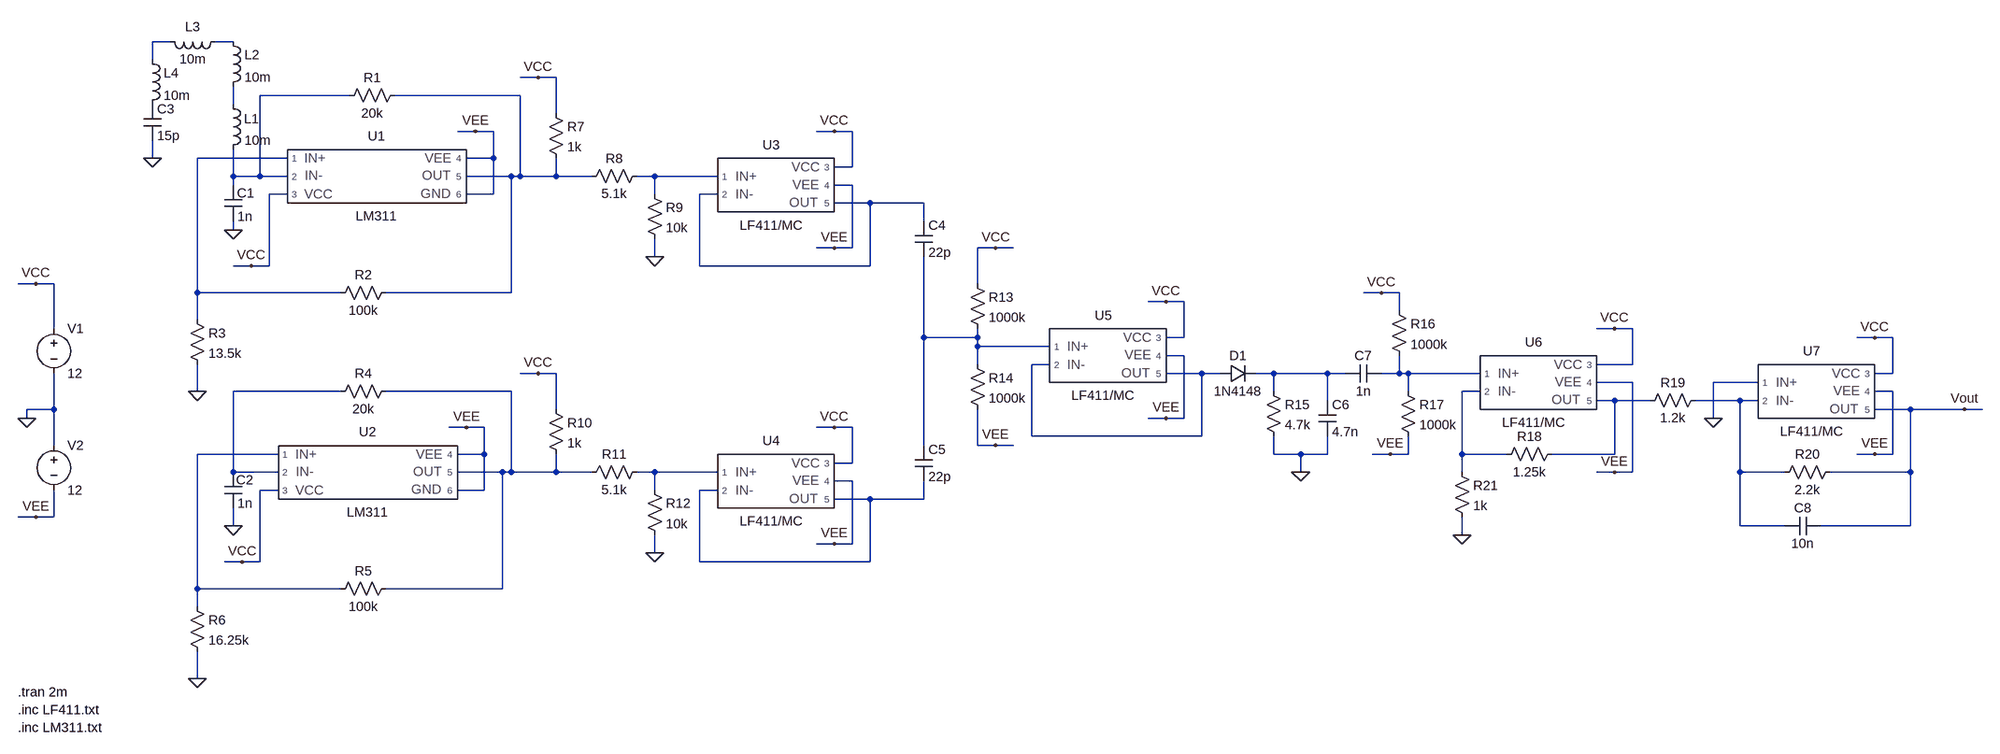
[diagram p0: schematic theremin.asc]
theremin.asc, the LTspice schematic file:
Version 4
SHEET 1 2708 820
WIRE -544 -480 -576 -480
WIRE -432 -480 -464 -480
WIRE -576 -448 -576 -480
WIRE 112 -416 80 -416
WIRE 144 -416 112 -416
WIRE -224 -384 -384 -384
WIRE 80 -384 -144 -384
WIRE -432 -368 -432 -400
WIRE 144 -352 144 -416
WIRE 0 -320 -32 -320
WIRE 32 -320 0 -320
WIRE 640 -320 608 -320
WIRE 672 -320 640 -320
WIRE -576 -272 -576 -304
WIRE -336 -272 -496 -272
WIRE 32 -272 32 -320
WIRE 32 -272 -16 -272
WIRE 672 -256 672 -320
WIRE 672 -256 640 -256
WIRE -432 -240 -432 -288
WIRE -384 -240 -384 -384
WIRE -384 -240 -432 -240
WIRE -336 -240 -384 -240
WIRE 64 -240 -16 -240
WIRE 80 -240 80 -384
WIRE 80 -240 64 -240
WIRE 144 -240 144 -272
WIRE 144 -240 80 -240
WIRE 208 -240 144 -240
WIRE 320 -240 288 -240
WIRE 432 -240 320 -240
WIRE -432 -224 -432 -240
WIRE 672 -224 640 -224
WIRE -336 -208 -368 -208
WIRE 32 -208 32 -272
WIRE 32 -208 -16 -208
WIRE 320 -208 320 -240
WIRE 432 -208 400 -208
WIRE 704 -192 640 -192
WIRE 800 -192 704 -192
WIRE 800 -160 800 -192
WIRE -432 -144 -432 -160
WIRE 640 -112 608 -112
WIRE 672 -112 672 -224
WIRE 672 -112 640 -112
WIRE 928 -112 896 -112
WIRE 960 -112 928 -112
WIRE 320 -96 320 -128
WIRE -400 -80 -432 -80
WIRE -368 -80 -368 -208
WIRE -368 -80 -400 -80
WIRE 400 -80 400 -208
WIRE 704 -80 704 -192
WIRE 704 -80 400 -80
WIRE -784 -48 -816 -48
WIRE -752 -48 -784 -48
WIRE 896 -48 896 -112
WIRE -496 -32 -496 -272
WIRE -240 -32 -496 -32
WIRE 64 -32 64 -240
WIRE 64 -32 -160 -32
WIRE 1616 -32 1584 -32
WIRE 1648 -32 1616 -32
WIRE 1232 -16 1200 -16
WIRE 1264 -16 1232 -16
WIRE 1648 0 1648 -32
WIRE -496 16 -496 -32
WIRE -752 32 -752 -48
WIRE 2032 32 2000 32
WIRE 2064 32 2032 32
WIRE 800 48 800 -96
WIRE 896 48 896 32
WIRE 896 48 800 48
WIRE 1264 48 1264 -16
WIRE 1264 48 1232 48
WIRE 2496 48 2464 48
WIRE 2528 48 2496 48
WIRE 896 64 896 48
WIRE 1024 64 896 64
WIRE 1264 80 1232 80
WIRE 896 96 896 64
WIRE 1024 96 992 96
WIRE 2064 96 2064 32
WIRE 2064 96 2000 96
WIRE 112 112 80 112
WIRE 144 112 112 112
WIRE 1296 112 1232 112
WIRE 1328 112 1296 112
WIRE 1424 112 1392 112
WIRE 1520 112 1424 112
WIRE 1552 112 1520 112
WIRE 1648 112 1648 80
WIRE 1648 112 1616 112
WIRE 1664 112 1648 112
WIRE 1792 112 1664 112
WIRE 2528 112 2528 48
WIRE 2528 112 2496 112
WIRE 2064 128 2000 128
WIRE 2288 128 2208 128
WIRE -496 144 -496 96
WIRE -240 144 -432 144
WIRE 64 144 -160 144
WIRE 1424 144 1424 112
WIRE 1664 144 1664 112
WIRE 1792 144 1760 144
WIRE 2528 144 2496 144
WIRE 1520 160 1520 112
WIRE 2032 160 2000 160
WIRE 2096 160 2032 160
WIRE 2256 160 2176 160
WIRE 2288 160 2256 160
WIRE -752 176 -752 112
WIRE -752 176 -800 176
WIRE 144 176 144 112
WIRE 2560 176 2496 176
WIRE 2656 176 2560 176
WIRE 2688 176 2656 176
WIRE -800 192 -800 176
WIRE 1232 192 1200 192
WIRE 1264 192 1264 80
WIRE 1264 192 1232 192
WIRE 2208 192 2208 128
WIRE -16 208 -48 208
WIRE 16 208 -16 208
WIRE 640 208 608 208
WIRE 672 208 640 208
WIRE 992 224 992 96
WIRE 1296 224 1296 112
WIRE 1296 224 992 224
WIRE -752 240 -752 176
WIRE 800 240 800 48
WIRE 896 240 896 176
WIRE 928 240 896 240
WIRE 960 240 928 240
WIRE -352 256 -496 256
WIRE 16 256 16 208
WIRE 16 256 -32 256
WIRE 1424 256 1424 224
WIRE 1472 256 1424 256
WIRE 1520 256 1520 224
WIRE 1520 256 1472 256
WIRE 1632 256 1600 256
WIRE 1664 256 1664 224
WIRE 1664 256 1632 256
WIRE 1760 256 1760 144
WIRE 1840 256 1760 256
WIRE 2032 256 2032 160
WIRE 2032 256 1920 256
WIRE 2496 256 2464 256
WIRE 2528 256 2528 144
WIRE 2528 256 2496 256
WIRE 672 272 672 208
WIRE 672 272 640 272
WIRE -432 288 -432 144
WIRE -352 288 -432 288
WIRE 48 288 -32 288
WIRE 64 288 64 144
WIRE 64 288 48 288
WIRE 144 288 144 256
WIRE 144 288 64 288
WIRE 208 288 144 288
WIRE 320 288 288 288
WIRE 432 288 320 288
WIRE 1472 288 1472 256
WIRE 1760 288 1760 256
WIRE 2032 288 2000 288
WIRE 2064 288 2064 128
WIRE 2064 288 2032 288
WIRE 2256 288 2256 160
WIRE 2336 288 2256 288
WIRE 2560 288 2560 176
WIRE 2560 288 2416 288
WIRE 672 304 640 304
WIRE -352 320 -384 320
WIRE 16 320 16 256
WIRE 16 320 -32 320
WIRE 320 320 320 288
WIRE 432 320 400 320
WIRE 704 336 640 336
WIRE 800 336 800 304
WIRE 800 336 704 336
WIRE -784 368 -816 368
WIRE -752 368 -752 320
WIRE -752 368 -784 368
WIRE -432 384 -432 352
WIRE 2256 384 2256 288
WIRE 2336 384 2256 384
WIRE 2560 384 2560 288
WIRE 2560 384 2400 384
WIRE 1760 400 1760 368
WIRE 640 416 608 416
WIRE 672 416 672 304
WIRE 672 416 640 416
WIRE 320 432 320 400
WIRE -416 448 -448 448
WIRE -384 448 -384 320
WIRE -384 448 -416 448
WIRE 400 448 400 320
WIRE 704 448 704 336
WIRE 704 448 400 448
WIRE -496 496 -496 256
WIRE -240 496 -496 496
WIRE 48 496 48 288
WIRE 48 496 -160 496
WIRE -496 528 -496 496
WIRE -496 656 -496 608
FLAG -800 192 0
FLAG -432 -144 0
FLAG -400 -80 VCC
FLAG -784 -48 VCC
FLAG -784 368 VEE
FLAG 0 -320 VEE
FLAG -496 144 0
FLAG -432 384 0
FLAG -416 448 VCC
FLAG -16 208 VEE
FLAG -496 656 0
FLAG -576 -272 0
FLAG 112 -416 VCC
FLAG 320 -96 0
FLAG 640 -320 VCC
FLAG 640 -112 VEE
FLAG 112 112 VCC
FLAG 320 432 0
FLAG 640 208 VCC
FLAG 640 416 VEE
FLAG 928 240 VEE
FLAG 928 -112 VCC
FLAG 1232 -16 VCC
FLAG 1232 192 VEE
FLAG 1472 288 0
FLAG 1616 -32 VCC
FLAG 1632 256 VEE
FLAG 2032 288 VEE
FLAG 2032 32 VCC
FLAG 2208 192 0
FLAG 2496 48 VCC
FLAG 2496 256 VEE
FLAG 1760 400 0
FLAG 2656 176 Vout
DATAFLAG 960 64 ""
SYMBOL Misc\\LM311 -176 -240 R0
SYMATTR InstName U1
SYMBOL cap -448 -224 R0
WINDOW 0 23 14 Left 2
SYMATTR InstName C1
SYMATTR Value 1n
SYMBOL res -128 -400 R90
WINDOW 0 0 56 VBottom 2
WINDOW 3 32 56 VTop 2
SYMATTR InstName R1
SYMATTR Value 20k
SYMBOL voltage -752 16 R0
WINDOW 123 0 0 Left 0
WINDOW 39 0 0 Left 0
SYMATTR InstName V1
SYMATTR Value 12
SYMBOL voltage -752 224 R0
WINDOW 123 0 0 Left 0
WINDOW 39 0 0 Left 0
SYMATTR InstName V2
SYMATTR Value 12
SYMBOL res -144 -48 R90
WINDOW 0 0 56 VBottom 2
WINDOW 3 32 56 VTop 2
SYMATTR InstName R2
SYMATTR Value 100k
SYMBOL res -512 0 R0
SYMATTR InstName R3
SYMATTR Value 13.5k
SYMBOL Misc\\LM311 -192 288 R0
SYMATTR InstName U2
SYMBOL cap -448 288 R0
WINDOW 0 21 14 Left 2
SYMATTR InstName C2
SYMATTR Value 1n
SYMBOL res -144 128 R90
WINDOW 0 0 56 VBottom 2
WINDOW 3 32 56 VTop 2
SYMATTR InstName R4
SYMATTR Value 20k
SYMBOL res -144 480 R90
WINDOW 0 0 56 VBottom 2
WINDOW 3 32 56 VTop 2
SYMATTR InstName R5
SYMATTR Value 100k
SYMBOL res -512 512 R0
SYMATTR InstName R6
SYMATTR Value 16.25k
SYMBOL ind -448 -384 R0
WINDOW 0 35 42 Left 2
SYMATTR InstName L1
SYMATTR Value 10m
SYMBOL ind -448 -496 R0
SYMATTR InstName L2
SYMATTR Value 10m
SYMBOL ind -448 -496 R90
WINDOW 0 5 56 VBottom 2
WINDOW 3 32 56 VTop 2
SYMATTR InstName L3
SYMATTR Value 10m
SYMBOL ind -592 -464 R0
SYMATTR InstName L4
SYMATTR Value 10m
SYMBOL Misc\\LF411_MC 528 -224 R0
SYMATTR InstName U3
SYMBOL cap -592 -368 R0
SYMATTR InstName C3
SYMATTR Value 15p
SYMBOL res 128 -368 R0
SYMATTR InstName R7
SYMATTR Value 1k
SYMBOL res 304 -256 R90
WINDOW 0 0 56 VBottom 2
WINDOW 3 32 56 VTop 2
SYMATTR InstName R8
SYMATTR Value 5.1k
SYMBOL res 304 -224 R0
SYMATTR InstName R9
SYMATTR Value 10k
SYMBOL cap 784 -160 R0
SYMATTR InstName C4
SYMATTR Value 22p
SYMBOL Misc\\LF411_MC 528 304 R0
SYMATTR InstName U4
SYMBOL res 128 160 R0
SYMATTR InstName R10
SYMATTR Value 1k
SYMBOL res 304 272 R90
WINDOW 0 0 56 VBottom 2
WINDOW 3 32 56 VTop 2
SYMATTR InstName R11
SYMATTR Value 5.1k
SYMBOL res 304 304 R0
SYMATTR InstName R12
SYMATTR Value 10k
SYMBOL cap 784 240 R0
SYMATTR InstName C5
SYMATTR Value 22p
SYMBOL res 880 -64 R0
SYMATTR InstName R13
SYMATTR Value 1000k
SYMBOL res 880 80 R0
SYMATTR InstName R14
SYMATTR Value 1000k
SYMBOL Misc\\LF411_MC 1120 80 R0
SYMATTR InstName U5
SYMBOL diode 1328 128 R270
WINDOW 0 32 32 VTop 2
WINDOW 3 0 32 VBottom 2
SYMATTR InstName D1
SYMATTR Value 1N4148
SYMBOL res 1408 128 R0
SYMATTR InstName R15
SYMATTR Value 4.7k
SYMBOL cap 1504 160 R0
SYMATTR InstName C6
SYMATTR Value 4.7n
SYMBOL cap 1616 96 R90
WINDOW 0 0 32 VBottom 2
WINDOW 3 32 32 VTop 2
SYMATTR InstName C7
SYMATTR Value 1n
SYMBOL res 1632 -16 R0
SYMATTR InstName R16
SYMATTR Value 1000k
SYMBOL res 1648 128 R0
SYMATTR InstName R17
SYMATTR Value 1000k
SYMBOL Misc\\LF411_MC 1888 128 R0
SYMATTR InstName U6
SYMBOL res 1936 240 R90
WINDOW 0 0 56 VBottom 2
WINDOW 3 32 56 VTop 2
SYMATTR InstName R18
SYMATTR Value 1.25k
SYMBOL res 2192 144 R90
WINDOW 0 0 56 VBottom 2
WINDOW 3 32 56 VTop 2
SYMATTR InstName R19
SYMATTR Value 1.2k
SYMBOL Misc\\LF411_MC 2384 144 R0
SYMATTR InstName U7
SYMBOL res 2432 272 R90
WINDOW 0 0 56 VBottom 2
WINDOW 3 32 56 VTop 2
SYMATTR InstName R20
SYMATTR Value 2.2k
SYMBOL cap 2400 368 R90
WINDOW 0 0 32 VBottom 2
WINDOW 3 32 32 VTop 2
SYMATTR InstName C8
SYMATTR Value 10n
SYMBOL res 1744 272 R0
SYMATTR InstName R21
SYMATTR Value 1k
TEXT -816 680 Left 2 !.tran 2m
TEXT -816 712 Left 2 !.inc LF411.txt
TEXT -816 744 Left 2 !.inc LM311.txt

The netlist it stands for:
* theremin.asc
XU1 N006 N003 VCC VEE N004 VEE LM311  ; pins 1 2 3 4 5 6
C1 N003 0 1n
R1 N004 N003 20k
V1 VCC 0 12
V2 0 VEE 12
R2 N004 N006 100k
R3 N006 0 13.5k
XU2 N018 N013 VCC VEE N014 VEE LM311  ; pins 1 2 3 4 5 6
C2 N013 0 1n
R4 N014 N013 20k
R5 N014 N018 100k
R6 N018 0 16.25k
L1 N005 N003 10m
L2 N002 N005 10m
L3 N002 N001 10m
L4 N001 P001 10m
XU3 N007 N008 VCC VEE N008 LF411/MC  ; pins 1 2 3 4 5
C3 P001 0 15p
R7 VCC N004 1k
R8 N007 N004 5.1k
R9 N007 0 10k
C4 N008 N009 22p
XU4 N019 N020 VCC VEE N020 LF411/MC  ; pins 1 2 3 4 5
R10 VCC N014 1k
R11 N019 N014 5.1k
R12 N019 0 10k
C5 N009 N020 22p
R13 VCC N009 1000k
R14 N009 VEE 1000k
XU5 N009 N010 VCC VEE N010 LF411/MC  ; pins 1 2 3 4 5
D1 N010 N011 1N4148
R15 N011 0 4.7k
C6 N011 0 4.7n
C7 N012 N011 1n
R16 VCC N012 1000k
R17 N012 VEE 1000k
XU6 N012 N015 VCC VEE N016 LF411/MC  ; pins 1 2 3 4 5
R18 N016 N015 1.25k
R19 N017 N016 1.2k
XU7 0 N017 VCC VEE Vout LF411/MC  ; pins 1 2 3 4 5
R20 Vout N017 2.2k
C8 Vout N017 10n
R21 N015 0 1k
.model D D
.lib standard.dio
.tran 2m
.inc LF411.txt
.inc LM311.txt
.lib C:\Users\casey\Downloads\LM311.txt
.lib C:\Users\casey\Downloads\LF411.txt
.backanno
.end